# Altium schematic sheet CLKB_power_regulators.SchDoc
size A4
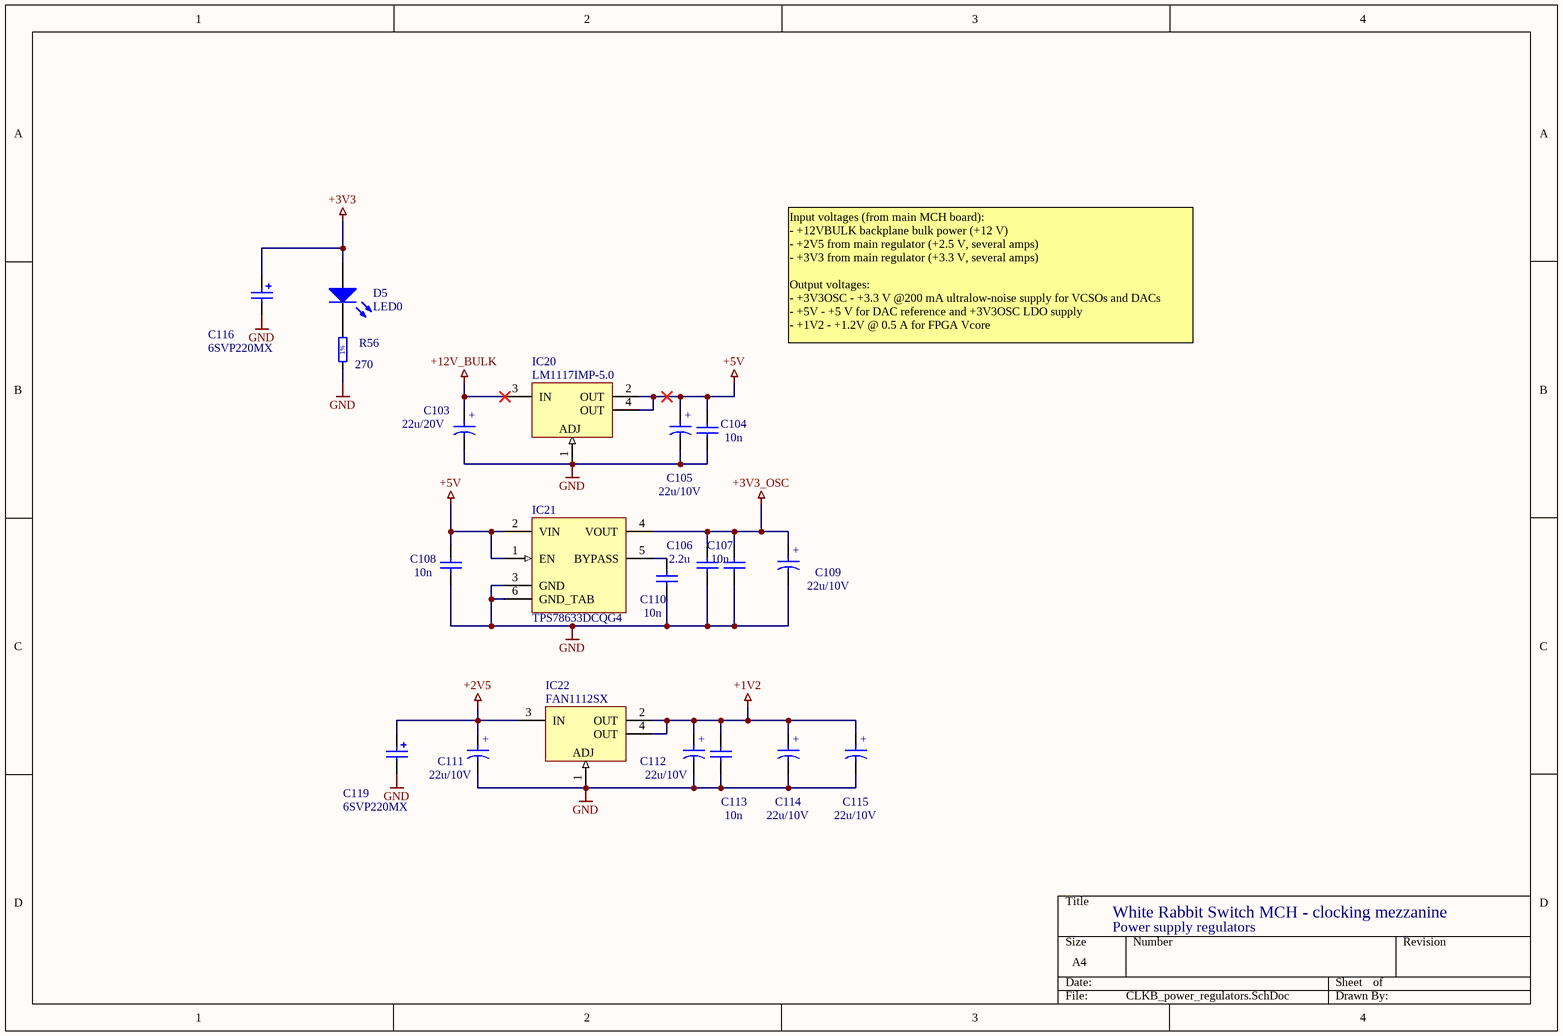
[diagram p0: CLKB_power_regulators.SchDoc]

## Parts
C103  22u/20V  [CAPMP3528X210N]
C104  22u/10V  [CAPMP3216X180N]
C105  10n  [CAPC1608X87N]
C106  2.2u  [CAPC2012X135N]
C107  10n  [CAPC1608X87N]
C108  10n  [CAPC1608X87N]
C109  22u/10V  [CAPMP3216X180N]
C110  10n  [CAPC1608X87N]
C111  22u/10V  [CAPMP3216X180N]
C112  10n  [CAPC1608X87N]
C113  22u/10V  [CAPMP3216X180N]
C114  22u/10V  [CAPMP3216X180N]
C115  22u/10V  [CAPMP3216X180N]
C116  value 6SVP220MX  [OSCON_E7]  (hidden comment: Cap Pol1)
C119  value 6SVP220MX  [OSCON_E7]  (hidden comment: Cap Pol1)
D5  LED0  [CD1608-0603]
IC20  value LM1117IMP-5.0  [SOT223-4L]  (hidden comment: LM1117)
IC21  value TPS78633DCQG4  [SOT223-6L]  (hidden comment: TPS786xx)
IC22  value FAN1112SX  [SOT223-4L]  (hidden comment: LM1117)
R56  270  [RESC1608X55N]

## Nets
+1V2: C112.2 C113.1 C114.1 C115.1 IC22.2(OUT) IC22.4(OUT)
+2V5: C111.1 C119.1 IC22.3(IN)
+3V3: C116.1 D5.1(A)
+3V3_OSC: C106.2 C107.2 C109.1 IC21.4(VOUT)
+5V: C104.1 C105.2 C108.2 IC20.2(OUT) IC20.4(OUT) IC21.1(EN) IC21.2(VIN)
+12V_BULK: C103.1 IC20.3(IN)
GND: C103.2 C104.2 C105.1 C106.1 C107.1 C108.1 C109.2 C110.1 C111.2 C112.1 C113.2 C114.2 C115.2 C116.2 C119.2 IC20.1(ADJ) IC21.3(GND) IC21.6(GND_TAB) IC22.1(ADJ) R56.1
NetC110_2: C110.2 IC21.5(BYPASS)
NetD5_2: D5.2(K) R56.2

## Notes on the sheet
- Input voltages (from main MCH board):
  - +12VBULK backplane bulk power (+12 V)
  - +2V5 from main regulator (+2.5 V, several amps)
  - +3V3 from main regulator (+3.3 V, several amps)
  Output voltages:
  - +3V3OSC - +3.3 V @200 mA ultralow-noise supply for VCSOs and DACs
  - +5V - +5 V for DAC reference and +3V3OSC LDO supply
  - +1V2 - +1.2V @ 0.5 A for FPGA Vcore
- White Rabbit Switch MCH - clocking mezzanine
- Power supply regulators
- (in symbol CTE3216-18_22UF_10V_10%) +
- (in symbol CTE3528-21_22UF_20V_10%) +
- (in symbol R0603_270R_1%_0.1W_100PPM) 1%

## Library data of the parts
C103 = CTE3528-21_22UF_20V_10%: Polarised capacitor; Part Description: Solid Tantalum Chip Capacitor; Manufacturer: GENERIC; Manufacturer1 Part Number: TAJB226K020R; Manufacturer1 Datasheet: \\cern.ch\dfs\Applications\Altium\Datasheets\CTE_AVX_TAJ.pdf; Value: 22uF; Voltage: 20V; Tolerance: ±10%; Table: Capacitors SMD; Part Number: CTE3528-21_22UF_20V_10%; Component Kind: Standard; Component Type: Standard; Designator: Capacitor - polarized; Library Reference: Capacitor - polarized; Pin Count: 2; Status: Preferred; Manufacturer Part Number: CTE3528-21_22UF_20V_10%; Case: B; Mounted: Yes; Socket: No; SMD: Yes; Manufacturer1 Example: AVX; Manufacturer1 ComponentHeight: 2.1mm; HelpURL: \\cern.ch\dfs\Applications\Altium\Datasheets\CTE_AVX_TAJ.pdf; Author: CERN DEM JLC; CreateDate: 12/3/2007; LatestRevisionDate: 12/3/2007
C104 C109 C111 C113-C115 = CTE3216-18_22UF_10V_10%: Polarised capacitor; Part Description: Solid Tantalum Chip Capacitor; Manufacturer: GENERIC; Manufacturer1 Part Number: TAJA226K010R; Manufacturer1 Datasheet: \\cern.ch\dfs\Applications\Altium\Datasheets\CTE_AVX_TAJ.pdf; Value: 22uF; Voltage: 10V; Tolerance: ±10%; Table: Capacitors SMD; Part Number: CTE3216-18_22UF_10V_10%; Component Kind: Standard; Component Type: Standard; Designator: Capacitor - polarized; Library Reference: Capacitor - polarized; Pin Count: 2; Status: Preferred; Manufacturer Part Number: CTE3216-18_22UF_10V_10%; Case: A; Mounted: Yes; Socket: No; SMD: Yes; Manufacturer1 Example: AVX; Manufacturer1 ComponentHeight: 1.8mm; HelpURL: \\cern.ch\dfs\Applications\Altium\Datasheets\CTE_AVX_TAJ.pdf; Author: CERN DEM JLC; CreateDate: 12/3/2007; LatestRevisionDate: 12/3/2007
C105 C107 C108 C110 C112 = CC0603_10NF_50V_10%_X7R: Non-polarised capacitor; Part Description: SMD Multilayer Chip Ceramic Capacitor; Manufacturer: GENERIC; Manufacturer1 Part Number: 223858615636; Manufacturer1 Datasheet: \\cern.ch\dfs\Applications\Altium\Datasheets\CC0603_X7R_PHYCOMP.pdf; Value: 10nF; Voltage: 50V; TC: X7R; Tolerance: ±10%; Table: Capacitors SMD; Part Number: CC0603_10NF_50V_10%_X7R; Component Kind: Standard; Component Type: Standard; Designator: Capacitor - non polarized; Library Reference: Capacitor - non polarized; Pin Count: 2; Status: Preferred; Manufacturer Part Number: CC0603_10NF_50V_10%_X7R; Case: 0603; Mounted: Yes; Socket: No; SMD: Yes; Manufacturer1 Example: PHYCOMP; Manufacturer1 ComponentHeight: 0.87mm; HelpURL: \\cern.ch\dfs\Applications\Altium\Datasheets\CC0603_X7R_PHYCOMP.pdf; Author: CERN DEM JLC; CreateDate: 12/3/2007; LatestRevisionDate: 12/3/2007
C106 = CC0805_2.2UF_16V_10%_X7R: Non-polarised capacitor; Part Description: SMD Multilayer Chip Ceramic Capacitor; Manufacturer: GENERIC; Manufacturer1 Part Number: GRM21BF51C225ZA01L; Manufacturer1 Datasheet: \\cern.ch\dfs\Applications\Altium\Datasheets\CC0805_X7R_KEMET.pdf; Value: 2.2uF; Voltage: 16V; TC: X7R; Tolerance: ±10%; Table: Capacitors SMD; Part Number: CC0805_2.2UF_16V_10%_X7R; Component Kind: Standard; Component Type: Standard; Designator: Capacitor - non polarized; Library Reference: Capacitor - non polarized; Pin Count: 2; Status: Preferred; Manufacturer Part Number: CC0805_2.2UF_16V_10%_X7R; Case: 0805; Mounted: Yes; Socket: No; SMD: Yes; Manufacturer1 Example: MURATA; Manufacturer1 ComponentHeight: 1.5mm; HelpURL: \\cern.ch\dfs\Applications\Altium\Datasheets\CC0805_X7R_KEMET.pdf; Author: CERN DEM JLC; CreateDate: 12/3/2007; LatestRevisionDate: 12/3/2007
C116 C119 = Cap Pol1: Polarized Capacitor (Radial); RefId: 9188819; Published: 8-Jun-2000; LatestRevisionDate: 17-Jul-2002; LatestRevisionNote: Re-released for DXP Platform.; PackageReference: RB7.6-15; Publisher: Altium Limited; Supplier: Farnell; ClassName: PSU_2V5
D5 = LED0: Red chip LED; Published: 8-Jun-2000; LatestRevisionDate: 08-Jul-2005; LatestRevisionNote: Mech Layer 1 removed.; PackageReference: LED-0; Publisher: Altium Limited
IC20 = 1117: Three-Terminal Adjustable Output Positive Voltage Regulator; Package Information: Latest Revision: 1997; Note: Heatsink surface connected to Pin 2; Code - JEDEC: TO-262-AA; RefId: 1469052; Published: 15-Apr-2002; Datasheet: Latest Revision: 1996; Package Reference: 221A-06; Publisher: Altium Limited; Supplier: Farnell
IC21 = TPS786xx: TI low noise LDO, 1A load; RefId: 1207352; Supplier: Farnell
IC22 = 1117: Three-Terminal Adjustable Output Positive Voltage Regulator; Package Information: Latest Revision: 1997; Note: Heatsink surface connected to Pin 2; Code - JEDEC: TO-262-AA; RefId: 1467363; Published: 15-Apr-2002; Datasheet: Latest Revision: 1996; Package Reference: 221A-06; Publisher: Altium Limited; Supplier: Farnell
R56 = R0603_270R_1%_0.1W_100PPM: Resistor - 1%; Part Description: General Purpose Thick Film Chip Resistor; Manufacturer: GENERIC; Manufacturer1 Part Number: NRC06F2700TRF; Manufacturer1 Datasheet: \\cern.ch\dfs\Applications\Altium\Datasheets\R0603_NIC_NRC.pdf; Power: 0.1W; TC: ±100ppm/°C; Table: Resistors SMD; Part Number: R0603_270R_1%_0.1W_100PPM; Component Kind: Standard; Component Type: Standard; Designator: Resistor - 1%; Library Reference: Resistor - 1%; Pin Count: 2; Value: 270; Status: Preferred; Tolerance: ±1%; Manufacturer Part Number: R0603_270R_1%_0.1W_100PPM; Case: 0603; Mounted: Yes; Socket: No; SMD: Yes; Manufacturer1 Example: NIC COMPONENT; Manufacturer1 ComponentHeight: 0.55mm; HelpURL: \\cern.ch\dfs\Applications\Altium\Datasheets\R0603_NIC_NRC.pdf; Author: CERN DEM JLC; CreateDate: 12/3/2007; LatestRevisionDate: 3/13/2008